# Altium schematic sheet record.SchDoc
size A4
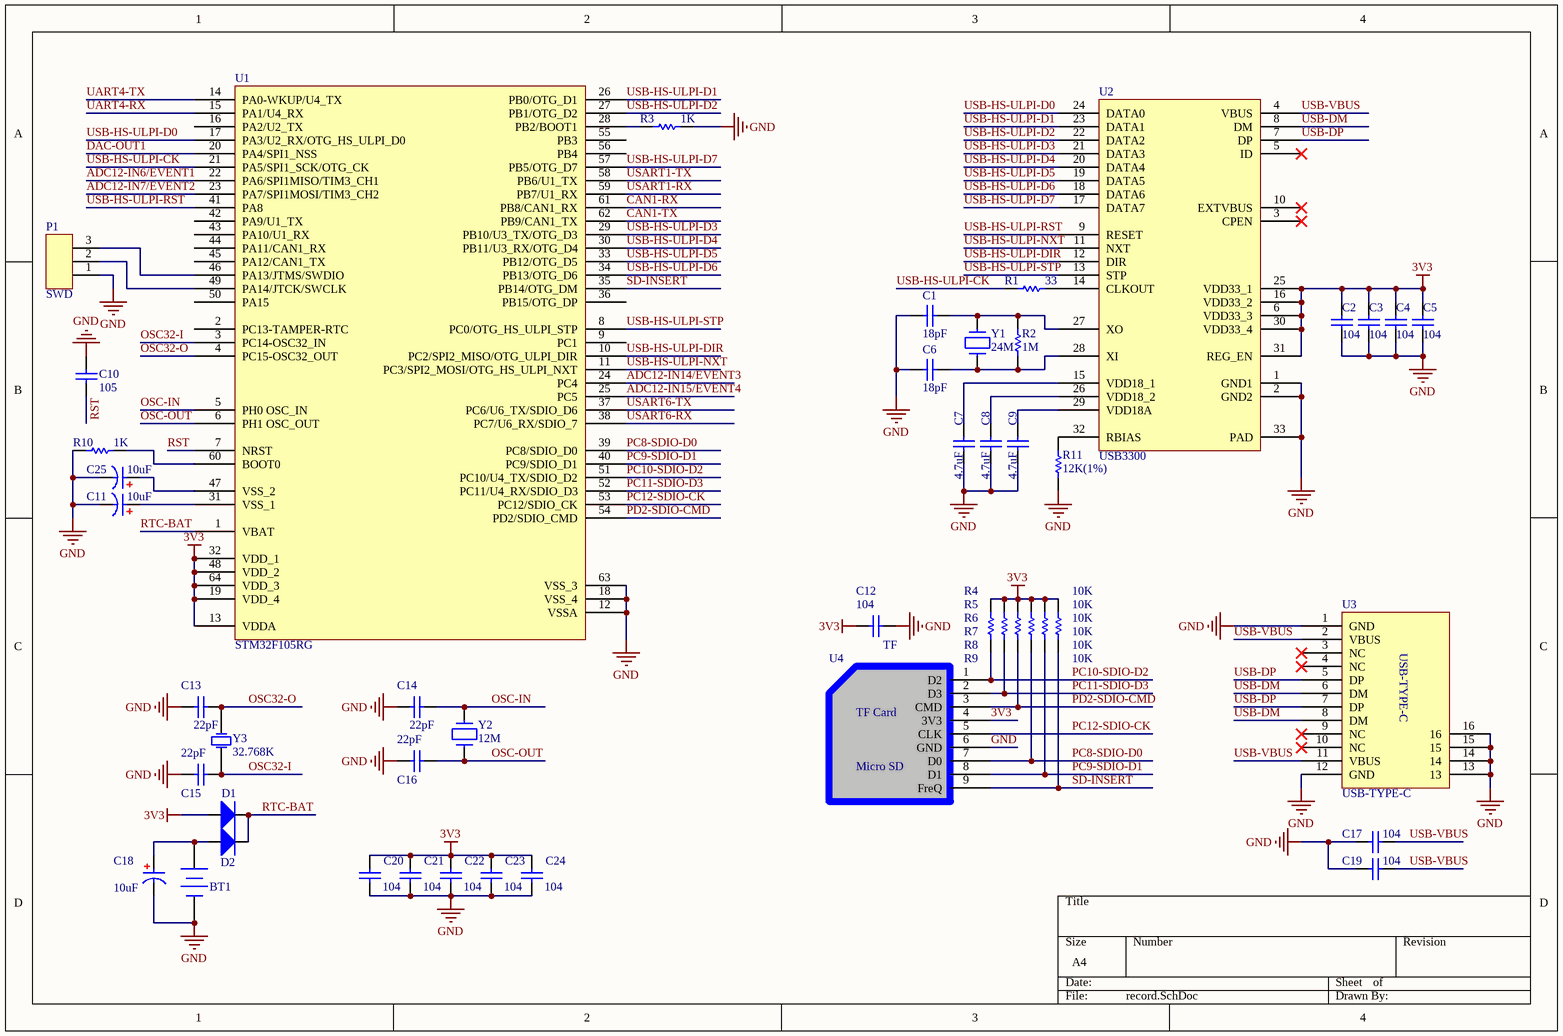
[diagram p0: record.SchDoc]

## Parts
BT1  Battery  [BAT1]  (value not drawn)
C1  C18pF  [0603R]  (value not drawn)
C2  104  [0603C]
C3  104  [0603C]
C4  104  [0603C]
C5  104  [0603C]
C6  C18pF  [0603R]  (value not drawn)
C7  C4.7uF  [0603R]  (value not drawn)
C8  C4.7uF  [0603R]  (value not drawn)
C9  C4.7uF  [0603R]  (value not drawn)
C10  C1uF  [0603C]  (value not drawn)
C11  C10uF  [0603C]  (value not drawn)
C12  C0.1uF  [0603C]  (value not drawn)
C13  C22pF  [0603R]  (value not drawn)
C14  C22pF  [0603R]  (value not drawn)
C15  C22pF  [0603R]  (value not drawn)
C16  C22pF  [0603R]  (value not drawn)
C17  104  [0603C]
C18  C10uF  [0603C]  (value not drawn)
C19  104  [0603C]
C20  104  [0603C]
C21  104  [0603C]
C22  104  [0603C]
C23  104  [0603C]
C24  104  [0603C]
C25  C10uF  [0603C]  (value not drawn)
D1  1N5822  [1206]  (value not drawn)
D2  1N5822  [1206]  (value not drawn)
P1  SWD  [head*3 - duplicate]
R1  R33  [0603R]  (value not drawn)
R2  R1M  [0603R]  (value not drawn)
R3  R1K  [0603R]  (value not drawn)
R4  R10K  [0603R]  (value not drawn)
R5  R10K  [0603R]  (value not drawn)
R6  R10K  [0603R]  (value not drawn)
R7  R10K  [0603R]  (value not drawn)
R8  R10K  [0603R]  (value not drawn)
R9  R10K  [0603R]  (value not drawn)
R10  R1K  [0603R]  (value not drawn)
R11  R12K(1%)  [0603R]  (value not drawn)
U1  STM32F105RG  [LQFP64]
U2  USB3300
U3  USB-TYPE-C
U4  TF  [TF CARD]
Y1  24M  [XTAL3225]
Y2  12M  [XTAL3225]
Y3  Y32.768K-3216  [CRY3215-2P]  (value not drawn)

## Nets
3V3: C2.2 C3.2 C4.2 C5.2 C12.2 C20.2 C21.2 C22.2 C23.2 C24.2 D1.1(A) R4.2 R5.2 R6.2 R7.2 R8.2 R9.2 U1.13(VDDA) U1.19(VDD_4) U1.32(VDD_1) U1.48(VDD_2) U1.64(VDD_3) U2.6(VDD33_3) U2.16(VDD33_2) U2.25(VDD33_1) U2.30(VDD33_4) U2.31(REG_EN) U4.4(3V3)
GND: BT1.2(-) C1.1 C2.1 C3.1 C4.1 C5.1 C6.1 C7.1 C8.1 C9.1 C10.2 C11.2 C12.1 C13.1 C14.1 C15.1 C16.1 C17.1 C18.2 C19.1 C20.1 C21.1 C22.1 C23.1 C24.1 C25.2 P1.1 R3.2 R10.1 R11.1 U1.12(VSSA) U1.18(VSS_4) U1.63(VSS_3) U2.1(GND1) U2.2(GND2) U2.33(PAD) U3.1(GND) U3.12(GND) U3.13 U3.14 U3.15 U3.16 U4.6(GND)
ADC12-IN6/EVENT1: U1.22(PA6/SPI1MISO/TIM3_CH1)
ADC12-IN7/EVENT2: U1.23(PA7/SPI1MOSI/TIM3_CH2)
ADC12-IN14/EVENT3: U1.24(PC4)
ADC12-IN15/EVENT4: U1.25(PC5)
CAN1-RX: U1.61(PB8/CAN1_RX)
CAN1-TX: U1.62(PB9/CAN1_TX)
DAC-OUT1: U1.20(PA4/SPI1_NSS)
OSC32-I: C15.2 U1.3(PC14-OSC32_IN) Y3.1(OSC1)
OSC32-O: C13.2 U1.4(PC15-OSC32_OUT) Y3.2(OSC2)
OSC-IN: C14.2 U1.5(PH0_OSC_IN) Y2.3
OSC-OUT: C16.2 U1.6(PH1_OSC_OUT) Y2.1
PC8-SDIO-D0: R7.1 U1.39(PC8/SDIO_D0) U4.7(D0)
PC9-SDIO-D1: R8.1 U1.40(PC9/SDIO_D1) U4.8(D1)
PC10-SDIO-D2: R4.1 U1.51(PC10/U4_TX/SDIO_D2) U4.1(D2)
PC11-SDIO-D3: R5.1 U1.52(PC11/U4_RX/SDIO_D3) U4.2(D3)
PC12-SDIO-CK: U1.53(PC12/SDIO_CK) U4.5(CLK)
PD2-SDIO-CMD: R6.1 U1.54(PD2/SDIO_CMD) U4.3(CMD)
RST: C10.1 U1.7(NRST)
RTC-BAT: D1.2(K) D2.2(K) U1.1(VBAT)
SD-INSERT: R9.1 U1.35(PB14/OTG_DM) U4.9(FreQ)
UART4-RX: U1.15(PA1/U4_RX)
UART4-TX: U1.14(PA0-WKUP/U4_TX)
USART1-RX: U1.59(PB7/U1_RX)
USART1-TX: U1.58(PB6/U1_TX)
USART6-RX: U1.38(PC7/U6_RX/SDIO_7)
USART6-TX: U1.37(PC6/U6_TX/SDIO_D6)
USB-DM: U2.8(DM) U3.6(DM) U3.8(DM)
USB-DP: U2.7(DP) U3.5(DP) U3.7(DP)
USB-HS-ULPI-CK: R1.1 U1.21(PA5/SPI1_SCK/OTG_CK)
USB-HS-ULPI-D0: U1.17(PA3/U2_RX/OTG_HS_ULPI_D0) U2.24(DATA0)
USB-HS-ULPI-D1: U1.26(PB0/OTG_D1) U2.23(DATA1)
USB-HS-ULPI-D2: U1.27(PB1/OTG_D2) U2.22(DATA2)
USB-HS-ULPI-D3: U1.29(PB10/U3_TX/OTG_D3) U2.21(DATA3)
USB-HS-ULPI-D4: U1.30(PB11/U3_RX/OTG_D4) U2.20(DATA4)
USB-HS-ULPI-D5: U1.33(PB12/OTG_D5) U2.19(DATA5)
USB-HS-ULPI-D6: U1.34(PB13/OTG_D6) U2.18(DATA6)
USB-HS-ULPI-D7: U1.57(PB5/OTG_D7) U2.17(DATA7)
USB-HS-ULPI-DIR: U1.10(PC2/SPI2_MISO/OTG_ULPI_DIR) U2.12(DIR)
USB-HS-ULPI-NXT: U1.11(PC3/SPI2_MOSI/OTG_HS_ULPI_NXT) U2.11(NXT)
USB-HS-ULPI-RST: U1.41(PA8) U2.9(RESET)
USB-HS-ULPI-STP: U1.8(PC0/OTG_HS_ULPI_STP) U2.13(STP)
USB-VBUS: C17.2 C19.2 U2.4(VBUS) U3.2(VBUS) U3.11(VBUS)
NetBT1_1: BT1.1(+) C18.1 D2.1(A)
NetC1_2: C1.2 R2.2 U2.27(XO) Y1.3
NetC6_2: C6.2 R2.1 U2.28(XI) Y1.1
NetC7_2: C7.2 U2.15(VDD18_1)
NetC8_2: C8.2 U2.26(VDD18_2)
NetC9_2: C9.2 U2.29(VDD18A)
NetC11_1: C11.1 U1.31(VSS_1)
NetC25_1: C25.1 U1.47(VSS_2)
NetP1_2: P1.2 U1.49(PA14/JTCK/SWCLK)
NetP1_3: P1.3 U1.46(PA13/JTMS/SWDIO)
NetR1_2: R1.2 U2.14(CLKOUT)
NetR3_1: R3.1 U1.28(PB2/BOOT1)
NetR10_2: R10.2 U1.60(BOOT0)
NetR11_2: R11.2 U2.32(RBIAS)

Not connected (* = marked no-connect by the designer): U1 2(PC13-TAMPER-RTC) 9(PC1) 16(PA2/U2_TX) 36(PB15/OTG_DP) 42(PA9/U1_TX) 43(PA10/U1_RX) 44(PA11/CAN1_RX) 45(PA12/CAN1_TX) 50(PA15) 55(PB3) 56(PB4); U2 3(CPEN)* 5(ID)* 10(EXTVBUS)*; U3 3(NC)* 4(NC)* 9(NC)* 10(NC)*

## Notes on the sheet
- (in symbol 0603C) 104
- (in symbol C0.1uF) 105
- (in symbol C10uF) 10uF
- (in symbol C22pF) 18pF; 4.7uF; 22pF
- (in symbol R1M) 1M; 12K(1%)
- (in symbol R10K) 10K; 1K
- (in symbol R22) 33
- (in symbol TF) TF Card; Micro SD
- (in symbol Y32.768K) 32.768K

## Library data of the parts
BT1 = Battery: Multicell Battery; Published: 24-Mar-1999; Revision: July-2002: Re-released for DXP Platform.; Publisher: Altium Limited
C1 C6-C9 = C22pF: 贴片电容
C2-C5 C10 C17 C19-C24 = C0.1uF
C12 = 0603C
P1 = head*3
R1 = R22
R3 R10 = R10K
R11 = R1M
U1 = STM32F405RG
Y1 Y2 = CRYSTAL
Y3 = Y32.768K